# Altium project int_lock.PrjPcb (part 2 of 2)
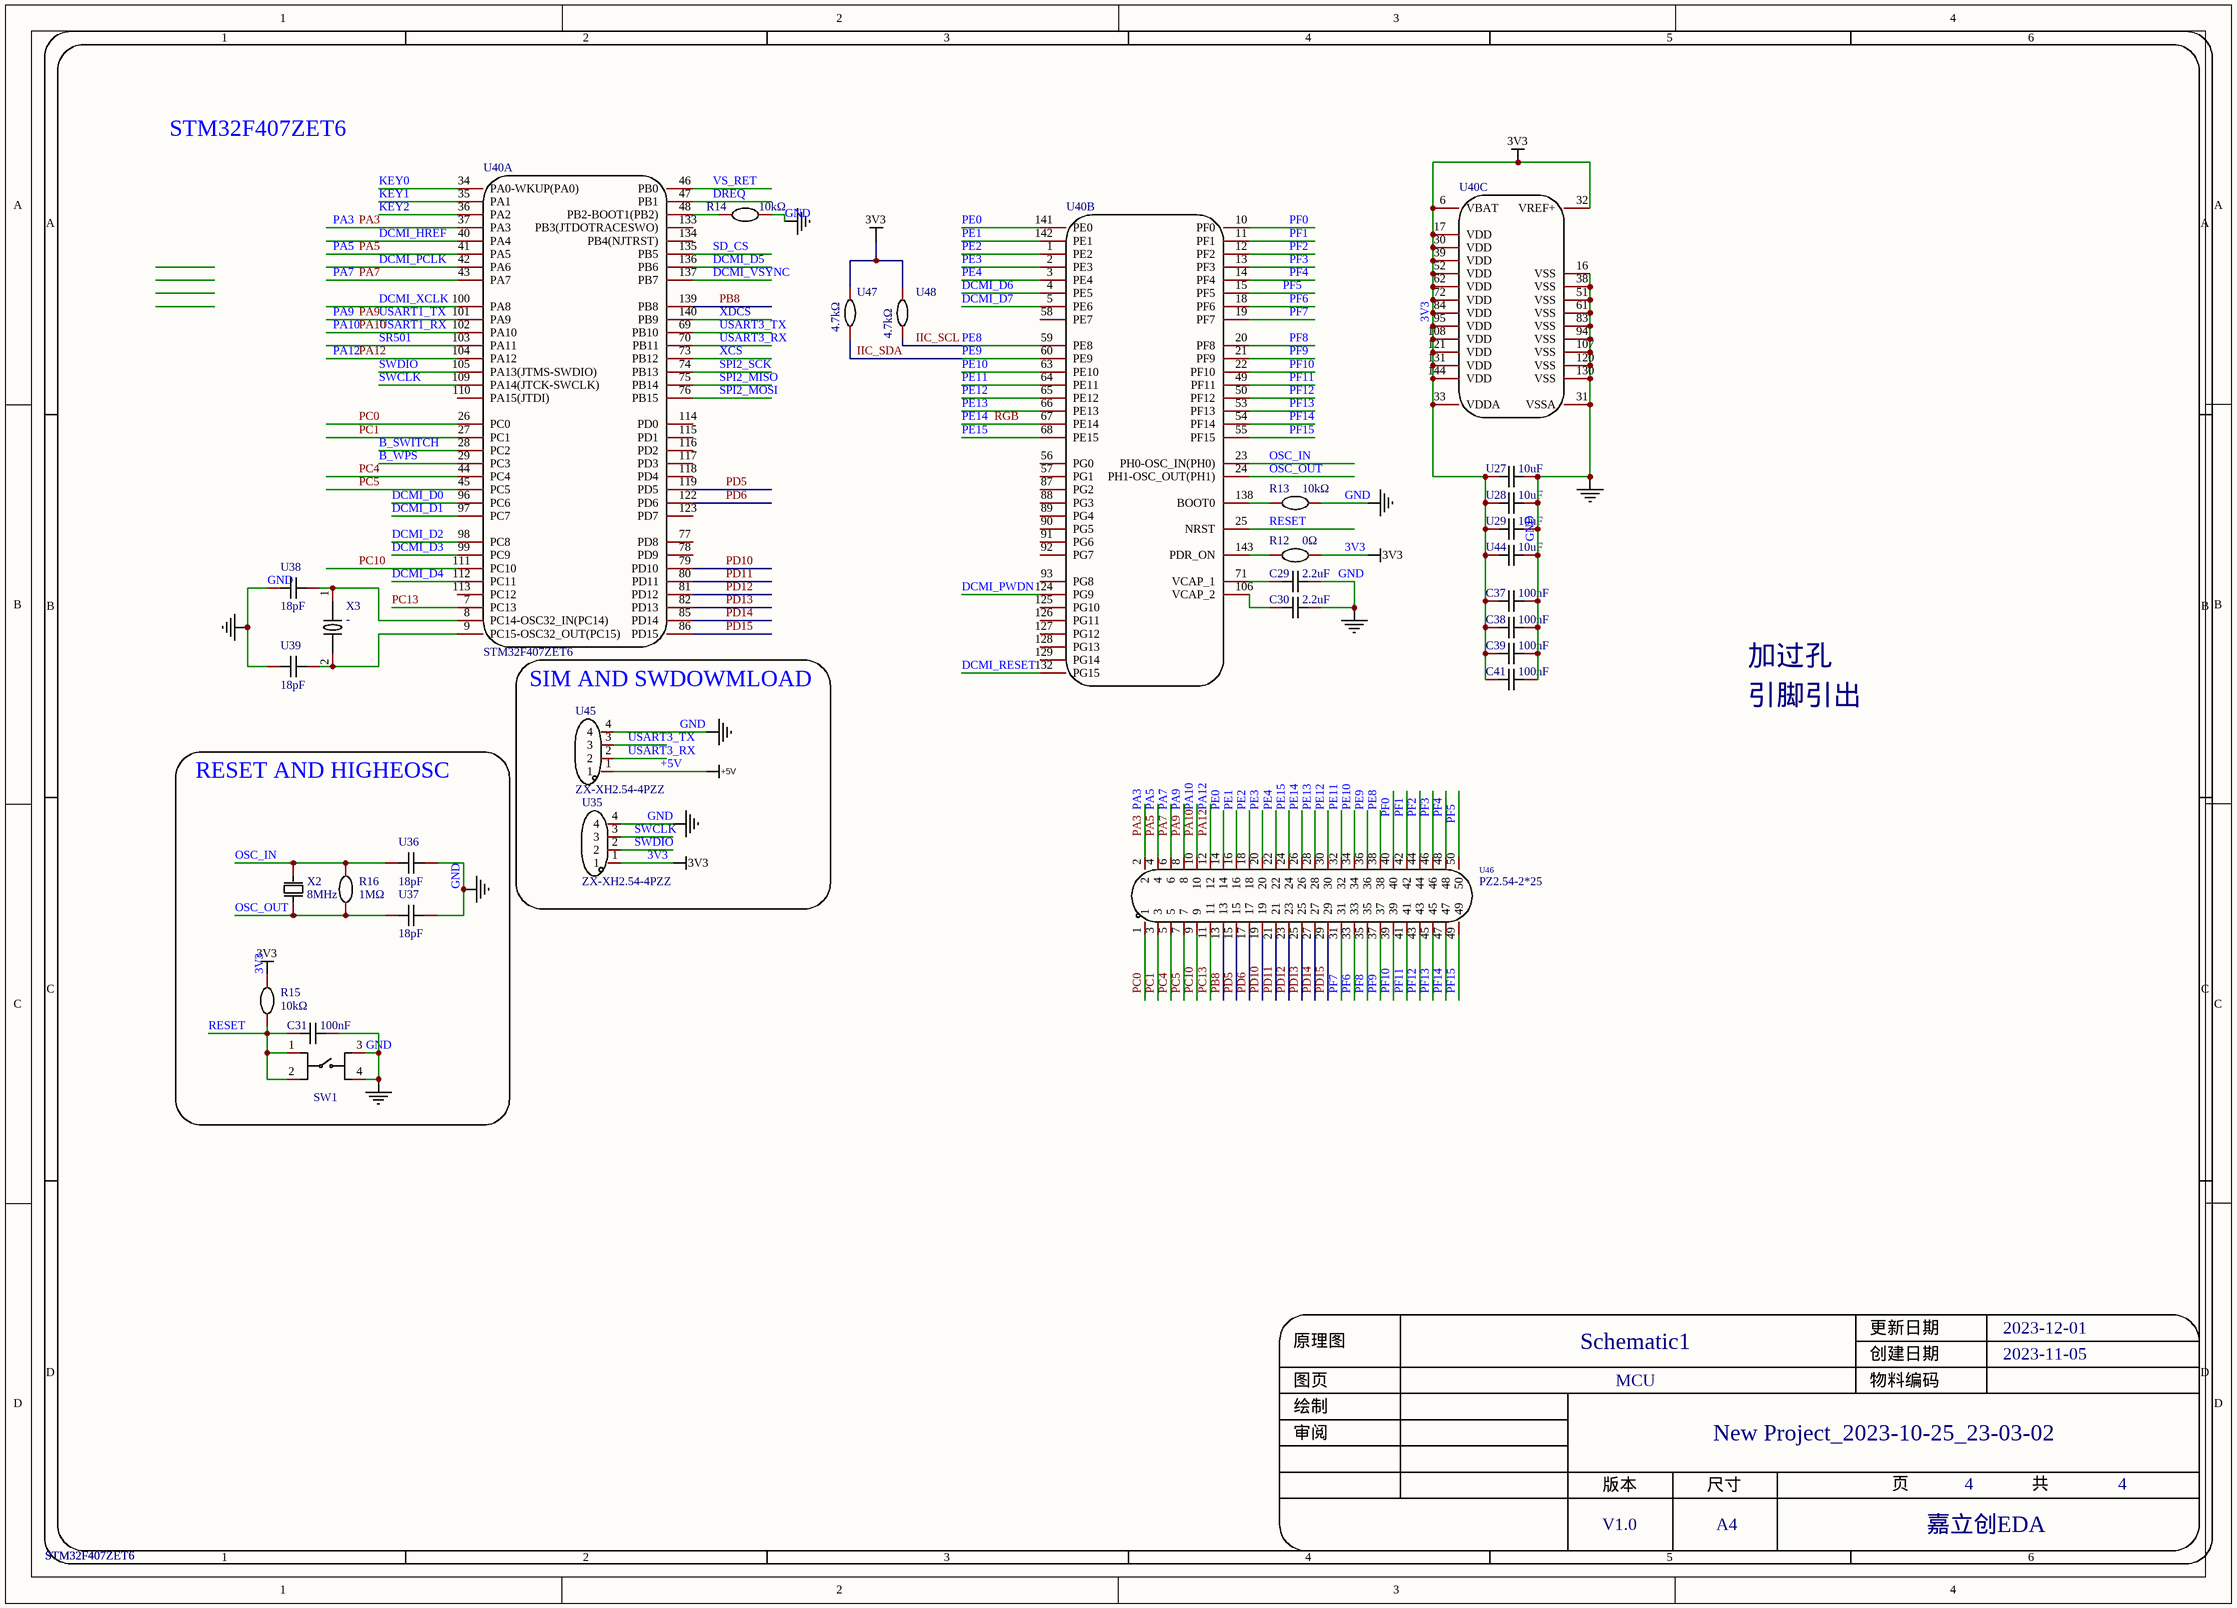
[diagram p4: 2_MCU.schdoc.schdoc]

## Nets that join several sheets
3V3: 4_POW.schdoc (11 pins), 3_语音模块.schdoc (7 pins), 1_Board.schdoc (7 pins), 2_MCU.schdoc (28 pins)
+5V: 4_POW.schdoc (13 pins), 3_语音模块.schdoc (C16.1 R8.2 U13.6), 1_Board.schdoc (6 pins), 2_MCU.schdoc (U45.1)
AVDD: 4_POW.schdoc (U22.2), 3_语音模块.schdoc (5 pins)
CVDD: 4_POW.schdoc (C11.2 C12.2 U10.2 U10.4), 3_语音模块.schdoc (5 pins)
GND: 4_POW.schdoc (32 pins), 3_语音模块.schdoc (28 pins), 1_Board.schdoc (24 pins), 2_MCU.schdoc (31 pins)
B_SWITCH: 1_Board.schdoc (U41.2), 2_MCU.schdoc (U40.28)
B_WPS: 1_Board.schdoc (U5.2), 2_MCU.schdoc (U40.29)
DCMI_D0: 1_Board.schdoc (U11.8), 2_MCU.schdoc (U40.96)
DCMI_D1: 1_Board.schdoc (U11.9), 2_MCU.schdoc (U40.97)
DCMI_D2: 1_Board.schdoc (U11.10), 2_MCU.schdoc (U40.98)
DCMI_D3: 1_Board.schdoc (U11.11), 2_MCU.schdoc (U40.99)
DCMI_D4: 1_Board.schdoc (U11.12), 2_MCU.schdoc (U40.112)
DCMI_D5: 1_Board.schdoc (U11.13), 2_MCU.schdoc (U40.136)
DCMI_D6: 1_Board.schdoc (U11.14), 2_MCU.schdoc (U40.4)
DCMI_D7: 1_Board.schdoc (U11.15), 2_MCU.schdoc (U40.5)
DCMI_HREF: 1_Board.schdoc (U11.5), 2_MCU.schdoc (U40.40)
DCMI_PCLK: 1_Board.schdoc (U11.16), 2_MCU.schdoc (U40.42)
DCMI_PWDN: 1_Board.schdoc (U11.18), 2_MCU.schdoc (U40.124)
DCMI_RESET: 1_Board.schdoc (U11.7), 2_MCU.schdoc (U40.132)
DCMI_VSYNC: 1_Board.schdoc (U11.3), 2_MCU.schdoc (U40.137)
DCMI_XCLK: 1_Board.schdoc (U11.17), 2_MCU.schdoc (U40.100)
DREQ: 3_语音模块.schdoc (U6.8), 2_MCU.schdoc (U40.47)
IIC_SCL: 1_Board.schdoc (U11.4), 2_MCU.schdoc (U40.59 U46.38 U48.2)
IIC_SDA: 1_Board.schdoc (U11.6), 2_MCU.schdoc (U40.60 U46.36 U47.2)
KEY0: 1_Board.schdoc (R17.1 SW2.3 SW2.4), 2_MCU.schdoc (U40.34)
KEY1: 1_Board.schdoc (R18.1 SW3.3 SW3.4), 2_MCU.schdoc (U40.35)
KEY2: 1_Board.schdoc (R19.1 SW4.3 SW4.4), 2_MCU.schdoc (U40.36)
PE14: 1_Board.schdoc (L3.4), 2_MCU.schdoc (U40.67 U46.26)
SD_CS: 1_Board.schdoc (CARD1.1), 2_MCU.schdoc (U40.135)
SPI2_MISO: 3_语音模块.schdoc (U6.30), 1_Board.schdoc (CARD1.7), 2_MCU.schdoc (U40.75)
SPI2_MOSI: 3_语音模块.schdoc (U6.29), 1_Board.schdoc (CARD1.2), 2_MCU.schdoc (U40.76)
SPI2_SCK: 3_语音模块.schdoc (U6.28), 1_Board.schdoc (CARD1.5), 2_MCU.schdoc (U40.74)
SR501: 1_Board.schdoc (H2.2 R50.2), 2_MCU.schdoc (U40.103)
VS_RET: 3_语音模块.schdoc (U6.3), 2_MCU.schdoc (U40.46)
XCS: 3_语音模块.schdoc (U6.23), 2_MCU.schdoc (U40.73)
XDCS: 3_语音模块.schdoc (U6.13), 2_MCU.schdoc (U40.140)